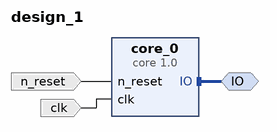
[diagram p0: block diagram of the top level]
# Vivado block design design_1, xc7z020clg484-1, Vivado 2018.2
create_bd_design design_1

create_bd_intf_port -mode Master -vlnv xilinx.com:user:IO_rtl:1.0 IO
create_bd_port -dir I n_reset
create_bd_port -dir I clk

create_bd_cell -type ip -vlnv xilinx.com:user:core:1.0 core_0

# ---- connections ----

connect_bd_intf_net [get_bd_intf_ports IO] [get_bd_intf_pins core_0/IO]
connect_bd_net [get_bd_ports n_reset] [get_bd_pins core_0/n_reset]
connect_bd_net [get_bd_ports clk] [get_bd_pins core_0/clk]

validate_bd_design
save_bd_design
